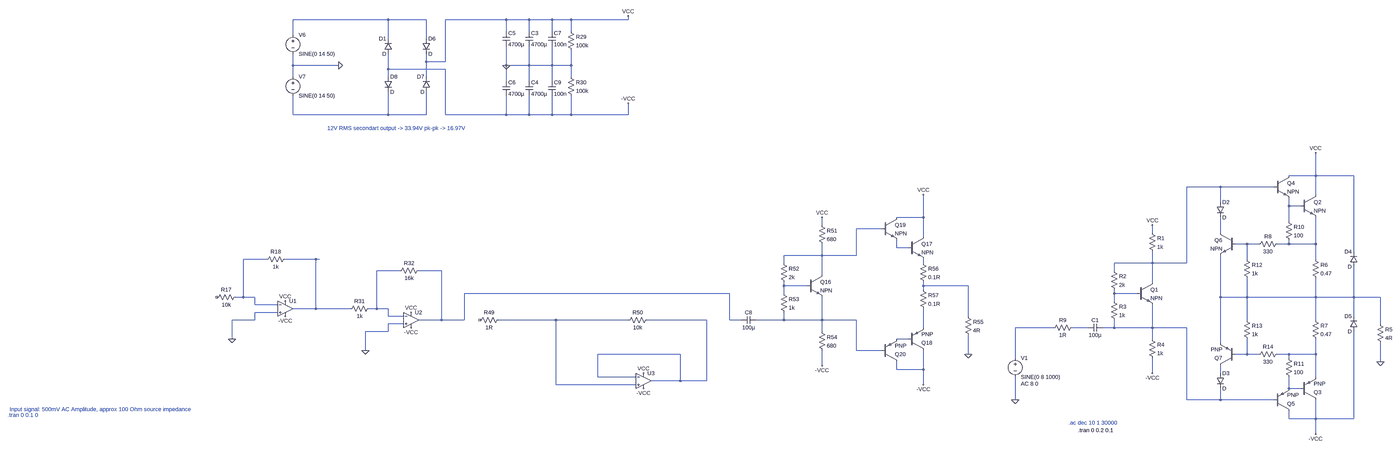
[diagram p0: schematic Draft2.asc, whole sheet]
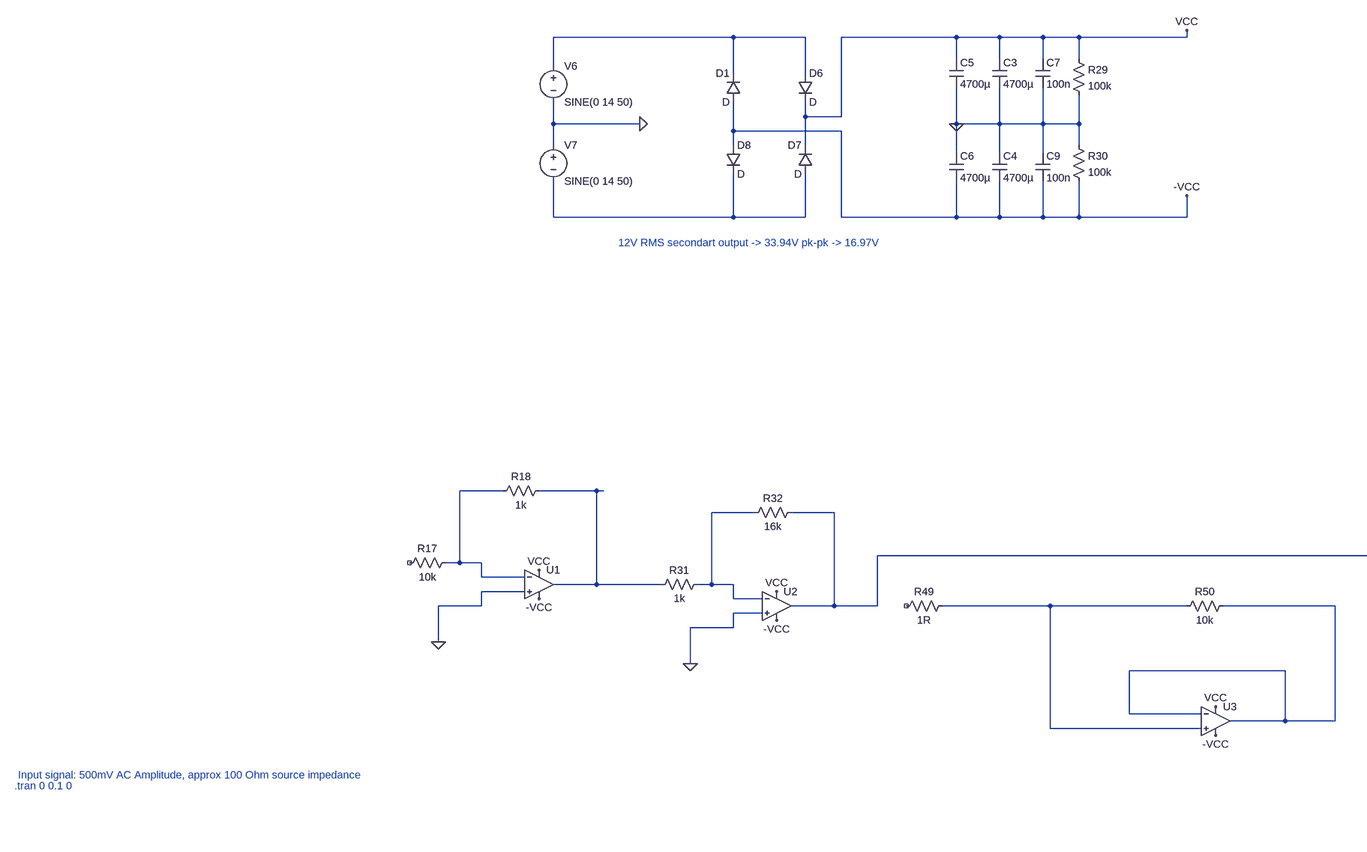
[diagram p1: schematic Draft2.asc, part, row 1 of 1, column 1 of 2]
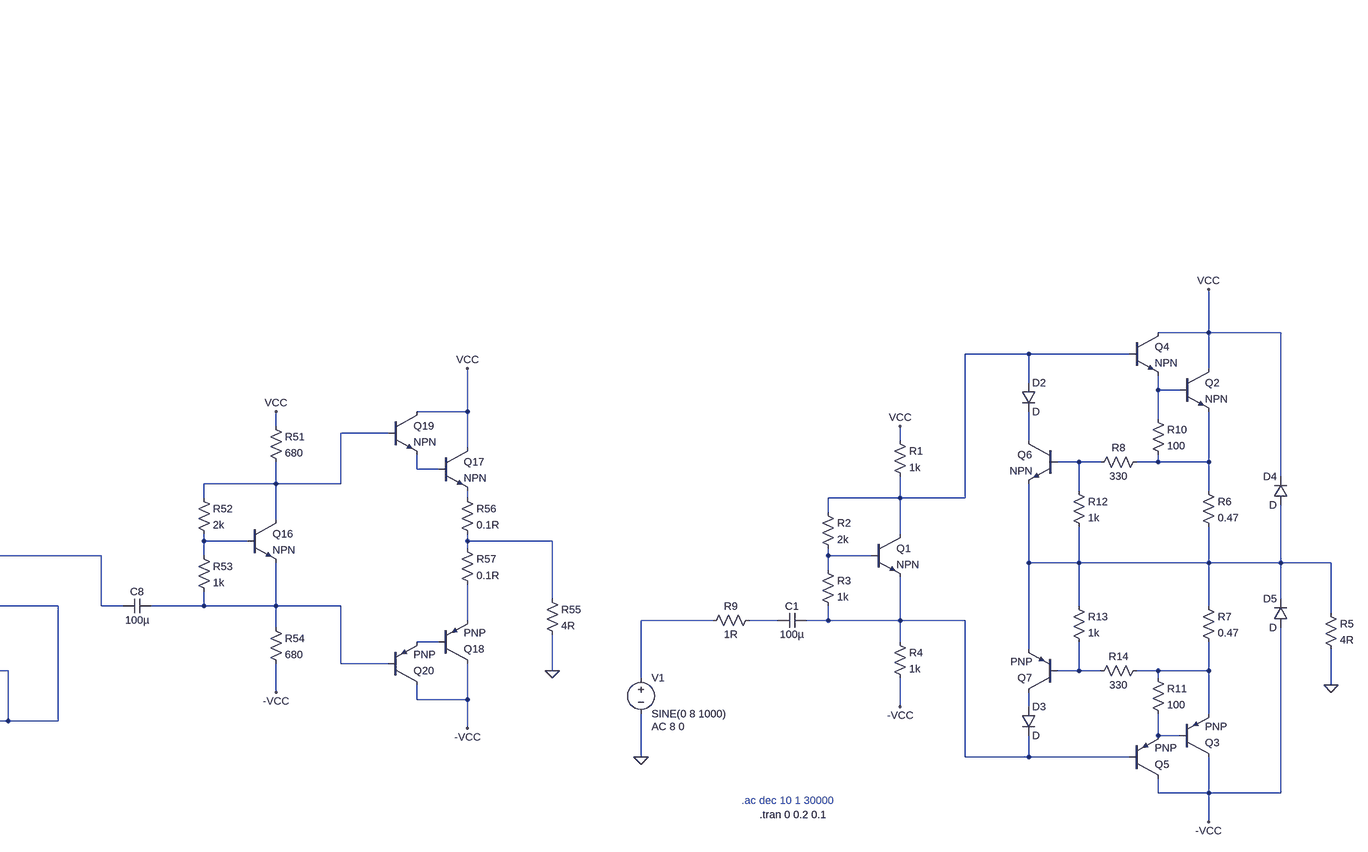
[diagram p2: schematic Draft2.asc, part, row 1 of 1, column 2 of 2]
Draft2.asc, the LTspice schematic file:
Version 4
SHEET 1 10148 680
WIRE 4496 -2448 4096 -2448
WIRE 4656 -2448 4496 -2448
WIRE 4992 -2448 4736 -2448
WIRE 5088 -2448 4992 -2448
WIRE 5184 -2448 5088 -2448
WIRE 5264 -2448 5184 -2448
WIRE 5504 -2448 5504 -2464
WIRE 5504 -2448 5264 -2448
WIRE 4992 -2400 4992 -2448
WIRE 5088 -2400 5088 -2448
WIRE 5184 -2400 5184 -2448
WIRE 5264 -2400 5264 -2448
WIRE 4096 -2384 4096 -2448
WIRE 4496 -2368 4496 -2448
WIRE 4656 -2368 4656 -2448
WIRE 4656 -2272 4656 -2304
WIRE 4736 -2272 4736 -2448
WIRE 4736 -2272 4656 -2272
WIRE 4096 -2256 4096 -2304
WIRE 4288 -2256 4096 -2256
WIRE 4992 -2256 4992 -2336
WIRE 5088 -2256 5088 -2336
WIRE 5088 -2256 4992 -2256
WIRE 5184 -2256 5184 -2336
WIRE 5184 -2256 5088 -2256
WIRE 5264 -2256 5264 -2320
WIRE 5264 -2256 5184 -2256
WIRE 4496 -2240 4496 -2304
WIRE 4736 -2240 4496 -2240
WIRE 4096 -2208 4096 -2256
WIRE 4496 -2208 4496 -2240
WIRE 4656 -2208 4656 -2272
WIRE 5264 -2208 5264 -2256
WIRE 4992 -2192 4992 -2256
WIRE 5088 -2192 5088 -2256
WIRE 5184 -2192 5184 -2256
WIRE 4096 -2048 4096 -2128
WIRE 4496 -2048 4496 -2144
WIRE 4496 -2048 4096 -2048
WIRE 4656 -2048 4656 -2144
WIRE 4656 -2048 4496 -2048
WIRE 4736 -2048 4736 -2240
WIRE 4992 -2048 4992 -2128
WIRE 4992 -2048 4736 -2048
WIRE 5088 -2048 5088 -2128
WIRE 5088 -2048 4992 -2048
WIRE 5184 -2048 5184 -2128
WIRE 5184 -2048 5088 -2048
WIRE 5264 -2048 5264 -2128
WIRE 5264 -2048 5184 -2048
WIRE 5504 -2048 5504 -2096
WIRE 5504 -2048 5264 -2048
WIRE 9184 -1792 9184 -1888
WIRE 9184 -1792 9072 -1792
WIRE 9344 -1792 9184 -1792
WIRE 8784 -1744 8544 -1744
WIRE 9008 -1744 8784 -1744
WIRE 9184 -1712 9184 -1792
WIRE 8784 -1680 8784 -1744
WIRE 9072 -1664 9072 -1696
WIRE 9120 -1664 9072 -1664
WIRE 6800 -1616 6800 -1712
WIRE 6800 -1616 6688 -1616
WIRE 9072 -1600 9072 -1664
WIRE 6368 -1584 6368 -1616
WIRE 6624 -1568 6512 -1568
WIRE 8400 -1552 8400 -1584
WIRE 8784 -1552 8784 -1616
WIRE 6800 -1536 6800 -1616
WIRE 8896 -1504 8848 -1504
WIRE 8944 -1504 8896 -1504
WIRE 9072 -1504 9072 -1520
WIRE 9072 -1504 9024 -1504
WIRE 9184 -1504 9184 -1616
WIRE 9184 -1504 9072 -1504
WIRE 6688 -1488 6688 -1520
WIRE 6736 -1488 6688 -1488
WIRE 9344 -1472 9344 -1792
WIRE 6368 -1456 6368 -1504
WIRE 6368 -1456 6208 -1456
WIRE 6512 -1456 6512 -1568
WIRE 6512 -1456 6368 -1456
WIRE 3984 -1440 3888 -1440
WIRE 4192 -1440 4064 -1440
WIRE 4208 -1440 4192 -1440
WIRE 8896 -1440 8896 -1504
WIRE 9184 -1440 9184 -1504
WIRE 6208 -1424 6208 -1456
WIRE 6800 -1424 6800 -1440
WIRE 8400 -1424 8400 -1472
WIRE 8400 -1424 8240 -1424
WIRE 8544 -1424 8544 -1744
WIRE 8544 -1424 8400 -1424
WIRE 4544 -1392 4448 -1392
WIRE 4720 -1392 4624 -1392
WIRE 8240 -1392 8240 -1424
WIRE 6368 -1376 6368 -1456
WIRE 8400 -1344 8400 -1424
WIRE 6208 -1328 6208 -1344
WIRE 6304 -1328 6208 -1328
WIRE 6800 -1328 6800 -1344
WIRE 7072 -1328 6800 -1328
WIRE 6800 -1312 6800 -1328
WIRE 5936 -1296 4816 -1296
WIRE 6208 -1296 6208 -1328
WIRE 8240 -1296 8240 -1312
WIRE 8336 -1296 8240 -1296
WIRE 3888 -1280 3888 -1440
WIRE 3888 -1280 3856 -1280
WIRE 3936 -1280 3888 -1280
WIRE 8784 -1280 8784 -1456
WIRE 8896 -1280 8896 -1360
WIRE 8896 -1280 8784 -1280
WIRE 9184 -1280 9184 -1360
WIRE 9184 -1280 8896 -1280
WIRE 9344 -1280 9344 -1408
WIRE 9344 -1280 9184 -1280
WIRE 9456 -1280 9344 -1280
WIRE 8240 -1264 8240 -1296
WIRE 3936 -1248 3936 -1280
WIRE 4032 -1248 3936 -1248
WIRE 4192 -1232 4192 -1440
WIRE 4192 -1232 4096 -1232
WIRE 4336 -1232 4192 -1232
WIRE 4448 -1232 4448 -1392
WIRE 4448 -1232 4416 -1232
WIRE 4496 -1232 4448 -1232
WIRE 4032 -1216 3936 -1216
WIRE 4496 -1200 4496 -1232
WIRE 4560 -1200 4496 -1200
WIRE 7072 -1200 7072 -1328
WIRE 9344 -1200 9344 -1280
WIRE 3936 -1184 3936 -1216
WIRE 3936 -1184 3840 -1184
WIRE 4720 -1184 4720 -1392
WIRE 4720 -1184 4624 -1184
WIRE 4816 -1184 4816 -1296
WIRE 4816 -1184 4720 -1184
WIRE 5200 -1184 4960 -1184
WIRE 5504 -1184 5200 -1184
WIRE 5840 -1184 5584 -1184
WIRE 5936 -1184 5936 -1296
WIRE 5984 -1184 5936 -1184
WIRE 6208 -1184 6208 -1216
WIRE 6208 -1184 6048 -1184
WIRE 6368 -1184 6368 -1280
WIRE 6368 -1184 6208 -1184
WIRE 6512 -1184 6368 -1184
WIRE 8896 -1184 8896 -1280
WIRE 9184 -1184 9184 -1280
WIRE 4560 -1168 4496 -1168
WIRE 9456 -1168 9456 -1280
WIRE 6800 -1152 6800 -1232
WIRE 7984 -1152 7824 -1152
WIRE 8128 -1152 8064 -1152
WIRE 8240 -1152 8240 -1184
WIRE 8240 -1152 8192 -1152
WIRE 8400 -1152 8400 -1248
WIRE 8400 -1152 8240 -1152
WIRE 8544 -1152 8400 -1152
WIRE 4496 -1136 4496 -1168
WIRE 4496 -1136 4400 -1136
WIRE 6368 -1136 6368 -1184
WIRE 3840 -1104 3840 -1184
WIRE 6736 -1104 6688 -1104
WIRE 8400 -1104 8400 -1152
WIRE 8784 -1088 8784 -1280
WIRE 4400 -1056 4400 -1136
WIRE 6512 -1056 6512 -1184
WIRE 6624 -1056 6512 -1056
WIRE 5728 -1040 5376 -1040
WIRE 7072 -1040 7072 -1120
WIRE 8896 -1040 8896 -1104
WIRE 8896 -1040 8848 -1040
WIRE 8944 -1040 8896 -1040
WIRE 9072 -1040 9024 -1040
WIRE 9184 -1040 9184 -1104
WIRE 9184 -1040 9072 -1040
WIRE 7824 -1024 7824 -1152
WIRE 9072 -1024 9072 -1040
WIRE 9456 -1008 9456 -1088
WIRE 6368 -992 6368 -1056
WIRE 6688 -976 6688 -1008
WIRE 6800 -976 6800 -1056
WIRE 6800 -976 6688 -976
WIRE 8400 -960 8400 -1024
WIRE 8784 -960 8784 -992
WIRE 5376 -944 5376 -1040
WIRE 5536 -944 5376 -944
WIRE 9184 -944 9184 -1040
WIRE 5728 -928 5728 -1040
WIRE 5728 -928 5600 -928
WIRE 5840 -928 5840 -1184
WIRE 5840 -928 5728 -928
WIRE 5200 -912 5200 -1184
WIRE 5536 -912 5200 -912
WIRE 6800 -912 6800 -976
WIRE 9072 -896 9072 -944
WIRE 9120 -896 9072 -896
WIRE 7824 -848 7824 -944
WIRE 8544 -848 8544 -1152
WIRE 8784 -848 8784 -896
WIRE 8784 -848 8544 -848
WIRE 9008 -848 8784 -848
WIRE 9072 -768 9072 -800
WIRE 9184 -768 9184 -848
WIRE 9184 -768 9072 -768
WIRE 9344 -768 9344 -1136
WIRE 9344 -768 9184 -768
WIRE 9184 -704 9184 -768
FLAG 4288 -2256 0
FLAG 4992 -2256 0
FLAG 5504 -2464 VCC
FLAG 5504 -2096 -VCC
FLAG 3840 -1104 0
FLAG 4400 -1056 0
FLAG 4064 -1200 -VCC
FLAG 4064 -1264 VCC
FLAG 6368 -1616 VCC
FLAG 6368 -992 -VCC
FLAG 6800 -1712 VCC
FLAG 6800 -912 -VCC
FLAG 7072 -1040 0
FLAG 4592 -1152 -VCC
FLAG 4592 -1216 VCC
FLAG 5568 -896 -VCC
FLAG 5568 -960 VCC
FLAG 8400 -1584 VCC
FLAG 8400 -960 -VCC
FLAG 9184 -1888 VCC
FLAG 9184 -704 -VCC
FLAG 9456 -1008 0
FLAG 7824 -848 0
SYMBOL voltage 4096 -2400 R0
WINDOW 123 0 0 Left 0
WINDOW 39 0 0 Left 0
SYMATTR InstName V6
SYMATTR Value SINE(0 14 50)
SYMBOL voltage 4096 -2224 R0
WINDOW 123 0 0 Left 0
WINDOW 39 0 0 Left 0
SYMATTR InstName V7
SYMATTR Value SINE(0 14 50)
SYMBOL diode 4512 -2304 R180
WINDOW 0 24 64 Left 2
WINDOW 3 24 0 Left 2
SYMATTR InstName D1
SYMBOL diode 4640 -2368 R0
SYMATTR InstName D6
SYMBOL diode 4672 -2144 R180
WINDOW 0 24 64 Left 2
WINDOW 3 24 0 Left 2
SYMATTR InstName D7
SYMBOL diode 4480 -2208 R0
SYMATTR InstName D8
SYMBOL cap 5072 -2400 R0
SYMATTR InstName C3
SYMATTR Value 4700µ
SYMBOL cap 5072 -2192 R0
SYMATTR InstName C4
SYMATTR Value 4700µ
SYMBOL res 5248 -2416 R0
SYMATTR InstName R29
SYMATTR Value 100k
SYMBOL res 5248 -2224 R0
SYMATTR InstName R30
SYMATTR Value 100k
SYMBOL cap 4976 -2400 R0
SYMATTR InstName C5
SYMATTR Value 4700µ
SYMBOL cap 4976 -2192 R0
SYMATTR InstName C6
SYMATTR Value 4700µ
SYMBOL cap 5168 -2400 R0
SYMATTR InstName C7
SYMATTR Value 100n
SYMBOL cap 5168 -2192 R0
SYMATTR InstName C9
SYMATTR Value 100n
SYMBOL res 3872 -1296 R90
WINDOW 0 0 56 VBottom 2
WINDOW 3 32 56 VTop 2
SYMATTR InstName R17
SYMATTR Value 10k
SYMBOL res 4080 -1456 R90
WINDOW 0 0 56 VBottom 2
WINDOW 3 32 56 VTop 2
SYMATTR InstName R18
SYMATTR Value 1k
SYMBOL res 4432 -1248 R90
WINDOW 0 0 56 VBottom 2
WINDOW 3 32 56 VTop 2
SYMATTR InstName R31
SYMATTR Value 1k
SYMBOL res 4640 -1408 R90
WINDOW 0 0 56 VBottom 2
WINDOW 3 32 56 VTop 2
SYMATTR InstName R32
SYMATTR Value 16k
SYMBOL res 4976 -1200 R90
WINDOW 0 0 56 VBottom 2
WINDOW 3 32 56 VTop 2
SYMATTR InstName R49
SYMATTR Value 1R
SYMBOL res 5600 -1200 R90
WINDOW 0 0 56 VBottom 2
WINDOW 3 32 56 VTop 2
SYMATTR InstName R50
SYMATTR Value 10k
SYMBOL cap 6048 -1200 R90
WINDOW 0 0 32 VBottom 2
WINDOW 3 32 32 VTop 2
SYMATTR InstName C8
SYMATTR Value 100µ
SYMBOL npn 6304 -1376 R0
SYMATTR InstName Q16
SYMBOL res 6352 -1600 R0
SYMATTR InstName R51
SYMATTR Value 680
SYMBOL res 6192 -1440 R0
SYMATTR InstName R52
SYMATTR Value 2k
SYMBOL res 6192 -1312 R0
SYMATTR InstName R53
SYMATTR Value 1k
SYMBOL res 6352 -1152 R0
SYMATTR InstName R54
SYMATTR Value 680
SYMBOL npn 6736 -1536 R0
SYMATTR InstName Q17
SYMBOL pnp 6736 -1056 M180
SYMATTR InstName Q18
SYMBOL res 7056 -1216 R0
SYMATTR InstName R55
SYMATTR Value 4R
SYMBOL npn 6624 -1616 R0
SYMATTR InstName Q19
SYMBOL pnp 6624 -1008 M180
SYMATTR InstName Q20
SYMBOL res 6784 -1440 R0
SYMATTR InstName R56
SYMATTR Value 0.1R
SYMBOL res 6784 -1328 R0
SYMATTR InstName R57
SYMATTR Value 0.1R
SYMBOL OpAmps\\UniversalOpAmp 4064 -1232 R0
SYMATTR InstName U1
SYMBOL OpAmps\\UniversalOpAmp 4592 -1184 R0
SYMATTR InstName U2
SYMBOL OpAmps\\UniversalOpAmp 5568 -928 R0
SYMATTR InstName U3
SYMBOL npn 8336 -1344 R0
SYMATTR InstName Q1
SYMBOL res 8384 -1568 R0
SYMATTR InstName R1
SYMATTR Value 1k
SYMBOL res 8224 -1408 R0
SYMATTR InstName R2
SYMATTR Value 2k
SYMBOL res 8224 -1280 R0
SYMATTR InstName R3
SYMATTR Value 1k
SYMBOL res 8384 -1120 R0
SYMATTR InstName R4
SYMATTR Value 1k
SYMBOL npn 9120 -1712 R0
SYMATTR InstName Q2
SYMBOL pnp 9120 -848 M180
SYMATTR InstName Q3
SYMBOL res 9440 -1184 R0
SYMATTR InstName R5
SYMATTR Value 4R
SYMBOL npn 9008 -1792 R0
SYMATTR InstName Q4
SYMBOL pnp 9008 -800 M180
SYMATTR InstName Q5
SYMBOL res 9168 -1456 R0
SYMATTR InstName R6
SYMATTR Value 0.47
SYMBOL res 9168 -1200 R0
SYMATTR InstName R7
SYMATTR Value 0.47
SYMBOL voltage 7824 -1040 R0
WINDOW 123 24 124 Left 2
WINDOW 39 0 0 Left 0
SYMATTR Value2 AC 8 0
SYMATTR InstName V1
SYMATTR Value SINE(0 8 1000)
SYMBOL res 8080 -1168 R90
WINDOW 0 0 56 VBottom 2
WINDOW 3 32 56 VTop 2
SYMATTR InstName R9
SYMATTR Value 1R
SYMBOL cap 8192 -1168 R90
WINDOW 0 0 32 VBottom 2
WINDOW 3 32 32 VTop 2
SYMATTR InstName C1
SYMATTR Value 100µ
SYMBOL res 9056 -1616 R0
SYMATTR InstName R10
SYMATTR Value 100
SYMBOL res 9056 -1040 R0
SYMATTR InstName R11
SYMATTR Value 100
SYMBOL npn 8848 -1552 M0
SYMATTR InstName Q6
SYMBOL diode 8768 -1680 R0
SYMATTR InstName D2
SYMBOL res 9040 -1520 R90
WINDOW 0 0 56 VBottom 2
WINDOW 3 32 56 VTop 2
SYMATTR InstName R8
SYMATTR Value 330
SYMBOL res 8880 -1456 R0
SYMATTR InstName R12
SYMATTR Value 1k
SYMBOL res 8880 -1200 R0
SYMATTR InstName R13
SYMATTR Value 1k
SYMBOL res 9040 -1056 R90
WINDOW 0 0 56 VBottom 2
WINDOW 3 32 56 VTop 2
SYMATTR InstName R14
SYMATTR Value 330
SYMBOL pnp 8848 -992 R180
SYMATTR InstName Q7
SYMBOL diode 8768 -960 R0
SYMATTR InstName D3
SYMBOL diode 9360 -1408 R180
WINDOW 0 24 64 Left 2
WINDOW 3 24 0 Left 2
SYMATTR InstName D4
SYMBOL diode 9360 -1136 R180
WINDOW 0 24 64 Left 2
WINDOW 3 24 0 Left 2
SYMATTR InstName D5
TEXT 2536 -784 Left 2 ;.tran 0 0.1 0
TEXT 2544 -808 Left 2 ;Input signal: 500mV AC Amplitude, approx 100 Ohm source impedance
TEXT 4240 -1992 Left 2 ;12V RMS secondart output -> 33.94V pk-pk -> 16.97V
TEXT 8088 -720 Left 2 !.tran 0 0.2 0.1
TEXT 8048 -752 Left 2 ;.ac dec 10 1 30000

The netlist it stands for:
* Draft2.asc
V6 N001 0 SINE(0 14 50)
V7 0 N002 SINE(0 14 50)
D1 -VCC N001 D
D6 N001 VCC D
D7 N002 VCC D
D8 -VCC N002 D
C3 VCC 0 4700µ
C4 0 -VCC 4700µ
R29 VCC 0 100k
R30 0 -VCC 100k
C5 VCC 0 4700µ
C6 0 -VCC 4700µ
C7 VCC 0 100n
C9 0 -VCC 100n
R17 N010 NC_01 10k
R18 N011 N010 1k
R31 N013 N011 1k
R32 N014 N013 16k
R49 N019 NC_02 1R
R50 N020 N019 10k
C8 N021 N014 100µ
Q16 N005 N015 N021 0 NPN
R51 VCC N005 680
R52 N005 N015 2k
R53 N015 N021 1k
R54 N021 -VCC 680
Q17 VCC N009 N012 0 NPN
Q18 -VCC N026 N022 0 PNP
R55 N016 0 4R
Q19 VCC N005 N009 0 NPN
Q20 -VCC N021 N026 0 PNP
R56 N012 N016 0.1R
R57 N016 N022 0.1R
XU1 0 N010 VCC -VCC N011 level1 Avol=1Meg GBW=10Meg Vos=0 En=0 Enk=0 In=0 Ink=0 Rin=500Meg  ; pins In+ In- V+ V- OUT
XU2 0 N013 VCC -VCC N014 level1 Avol=1Meg GBW=10Meg Vos=0 En=0 Enk=0 In=0 Ink=0 Rin=500Meg  ; pins In+ In- V+ V- OUT
XU3 N019 N020 VCC -VCC N020 level1 Avol=1Meg GBW=10Meg Vos=0 En=0 Enk=0 In=0 Ink=0 Rin=500Meg  ; pins In+ In- V+ V- OUT
Q1 N003 N017 N025 0 NPN
R1 VCC N003 1k
R2 N003 N017 2k
R3 N017 N025 1k
R4 N025 -VCC 1k
Q2 VCC N004 N008 0 NPN
Q3 -VCC N030 N028 0 PNP
R5 N018 0 4R
Q4 VCC N003 N004 0 NPN
Q5 -VCC N025 N030 0 PNP
R6 N008 N018 0.47
R7 N018 N028 0.47
V1 N023 0 SINE(0 8 1000) AC 8 0
R9 N024 N023 1R
C1 N025 N024 100µ
R10 N004 N008 100
R11 N028 N030 100
Q6 N006 N007 N018 0 NPN
D2 N003 N006 D
R8 N008 N007 330
R12 N007 N018 1k
R13 N018 N027 1k
R14 N028 N027 330
Q7 N029 N027 N018 0 PNP
D3 N029 N025 D
D4 N018 VCC D
D5 -VCC N018 D
.model D D
.lib standard.dio
.model NPN NPN
.model PNP PNP
.lib standard.bjt
* .tran 0 0.1 0
* Input signal: 500mV AC Amplitude, approx 100 Ohm source impedance
* 12V RMS secondart output -> 33.94V pk-pk -> 16.97V
.tran 0 0.2 0.1
* .ac dec 10 1 30000
.lib UniversalOpAmp1.lib
.backanno
.end